# Altium schematic sheet mPCIe_Breakout01_SCH-PAGE1_TITLE.SchDoc: Swarm mPCIe Breakout
size Tabloid; Date: 12/13/2021; DrawnBy: Liam Gallagher; DocumentNumber: 1; Revision: X1; SheetNumber: 1; SheetTotal: 3
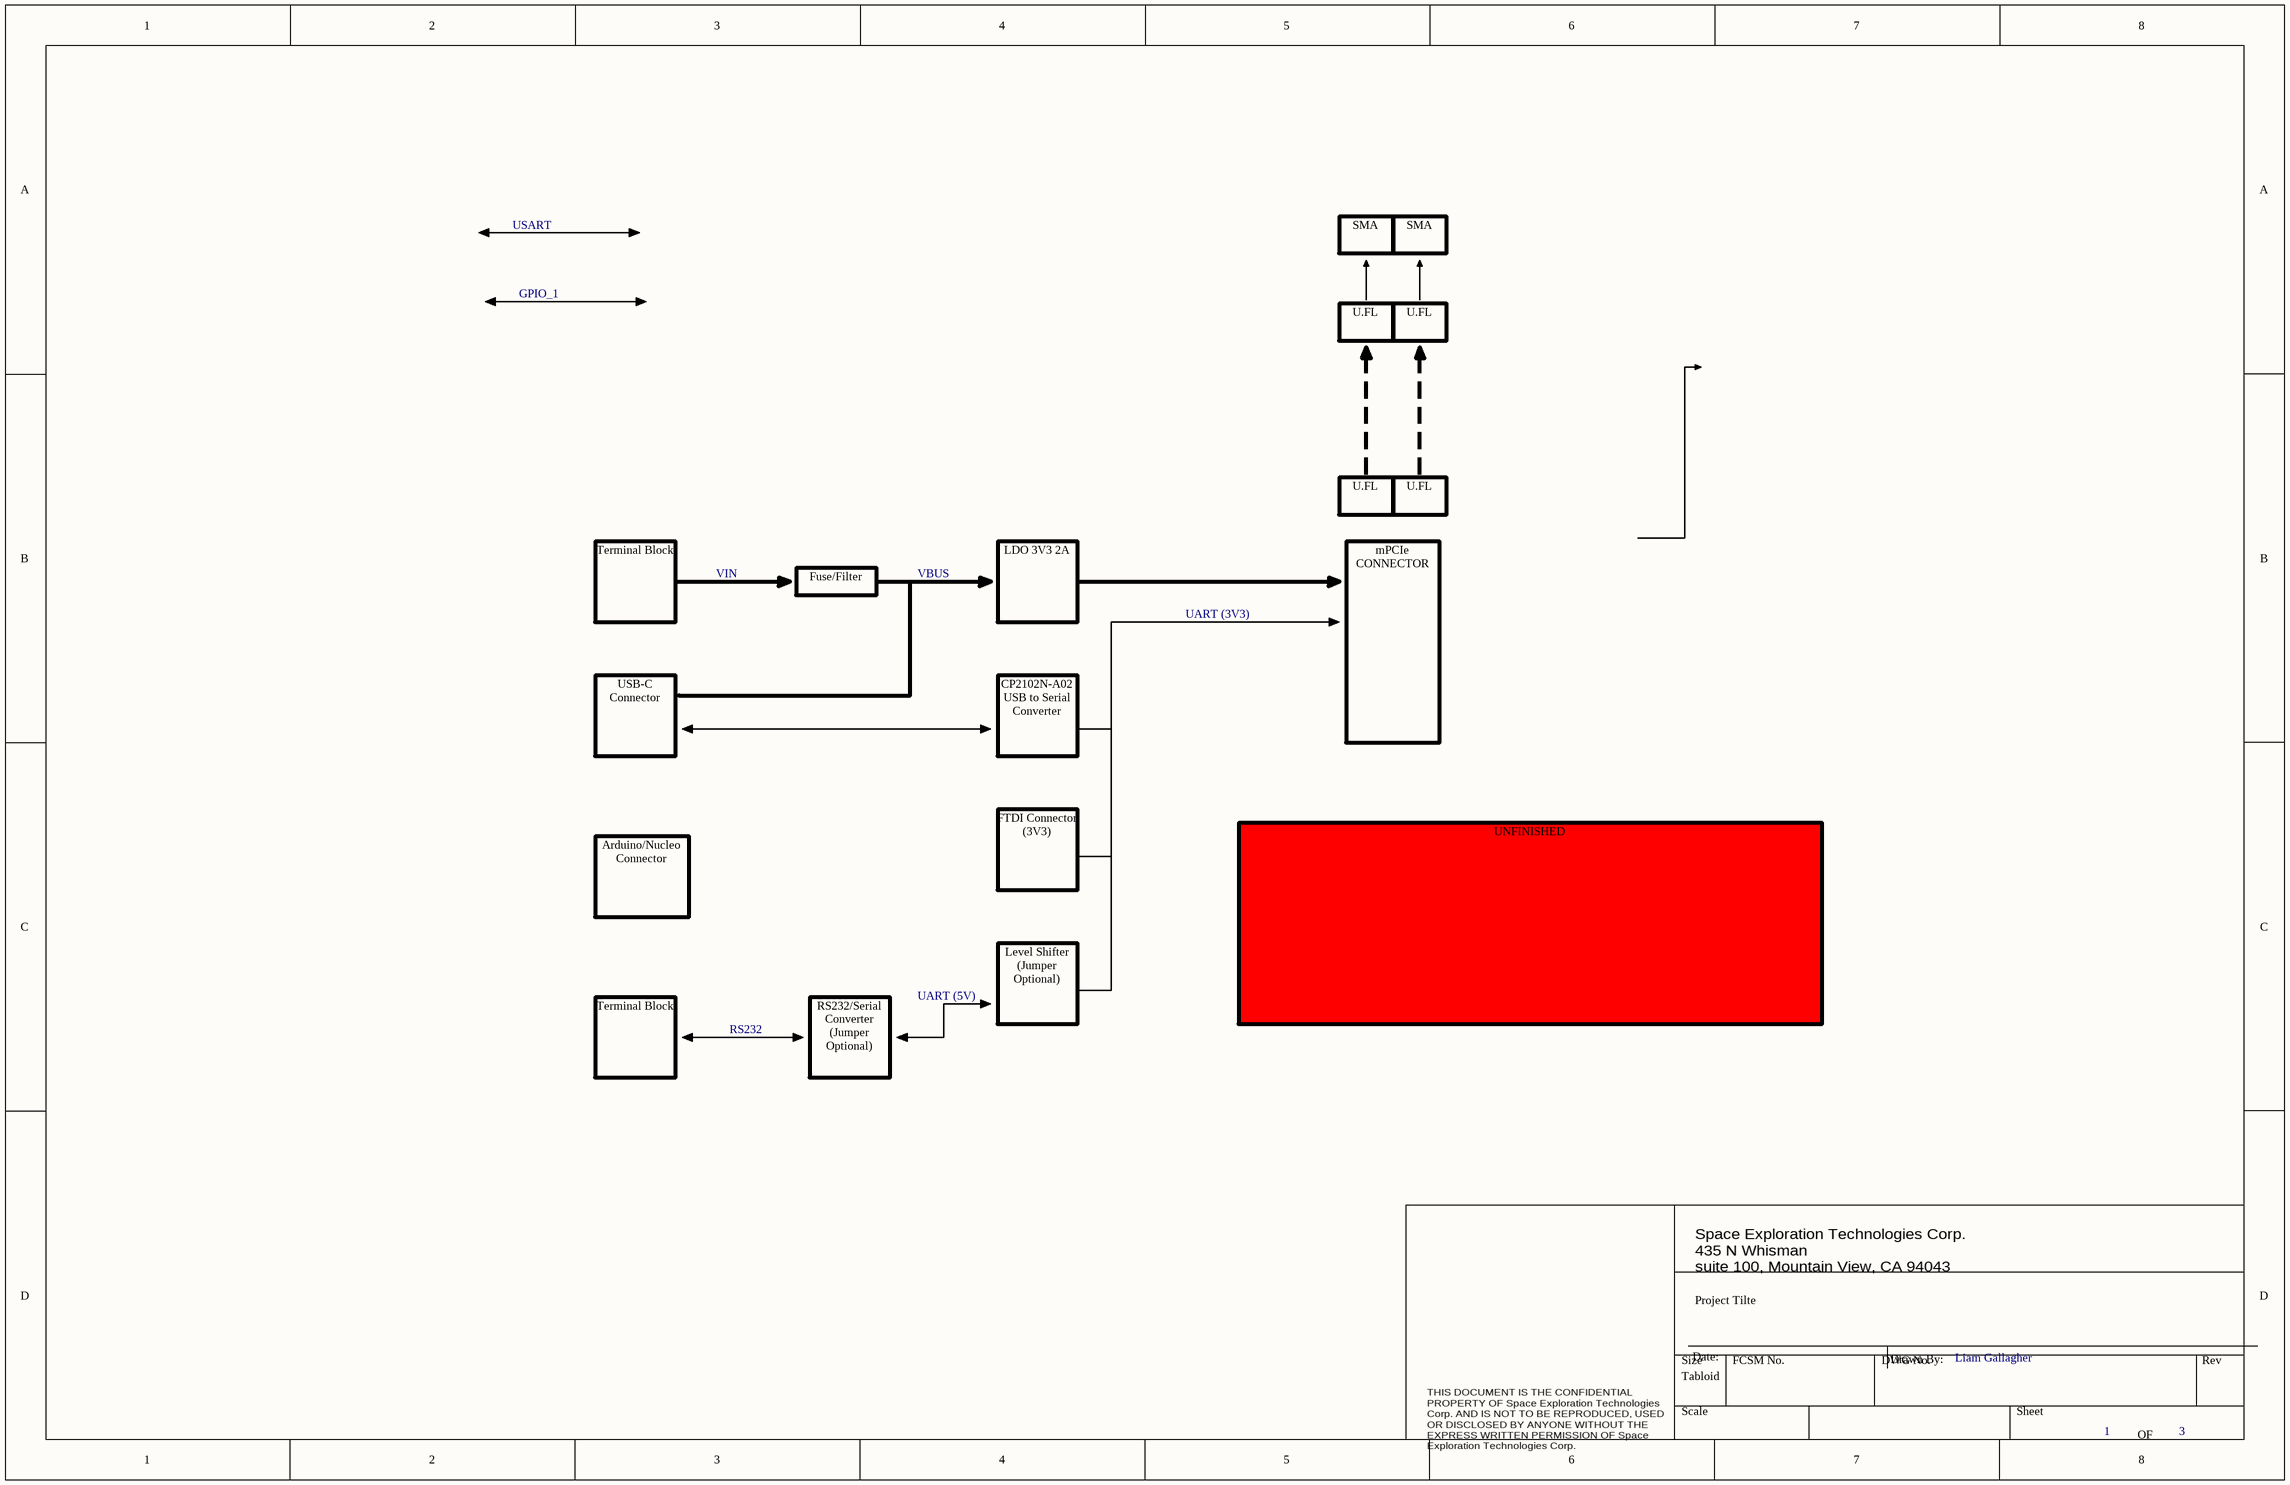
[diagram p0: mPCIe_Breakout01_SCH-PAGE1_TITLE.SchDoc]

## Notes on the sheet
- USART
- GPIO_1
- SMA
- U.FL
- Terminal Block
- VIN
- Fuse/Filter
- VBUS
- LDO 3V3 2A
- UART (3V3)
- USB-C Connector
- CP2102N-A02
  USB to Serial Converter
- mPCIe CONNECTOR
- FTDI Connector (3V3)
- Arduino/Nucleo Connector
- RS232
- UART (5V)
- Level Shifter
  (Jumper Optional)
- UNFINISHED
- RS232/Serial Converter
  (Jumper Optional)
- Space Exploration Technologies Corp.
  435 N Whisman
  suite 100, Mountain View, CA 94043
- CONFIDENTIAL
- Date:
- Project Tilte
- Drawn By:
- THIS DOCUMENT IS THE CONFIDENTIAL PROPERTY OF Space Exploration Technologies Corp. AND IS NOT TO BE REPRODUCED, USED OR DISCLOSED BY ANYONE WITHOUT THE EXPRESS WRITTEN PERMISSION OF Space Exploration Technologies Corp.
- OF